# EAGLE design ad7249 (EAGLE 6.1)
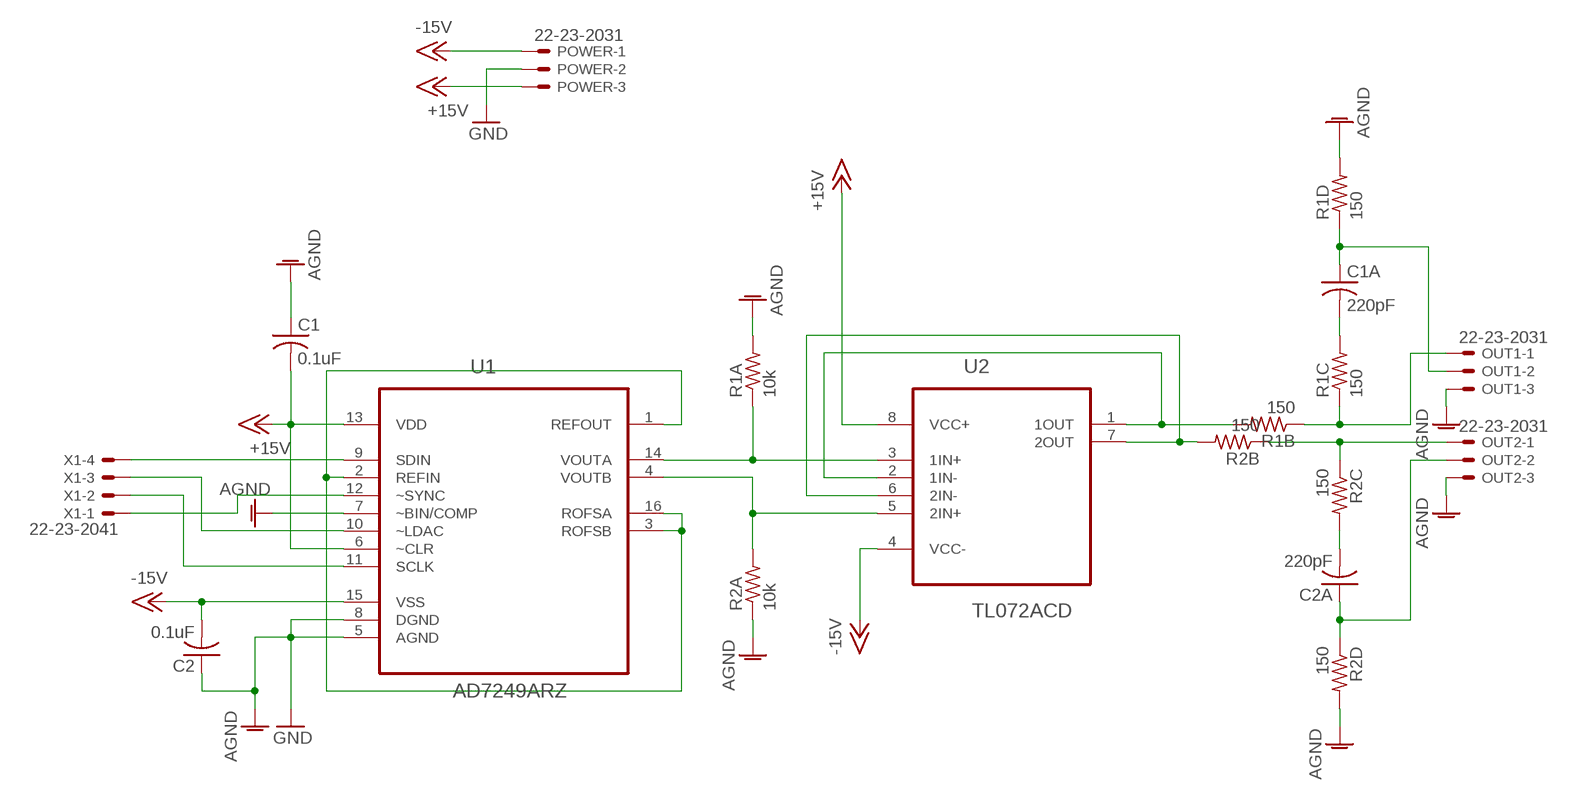
[diagram p0: schematic, sheet 1]

## Parts
C1  0.1uF  C-USC1206  [C1206]
C1A  220pF  C-USC1206  [C1206]
C2  0.1uF  C-USC1206  [C1206]
C2A  220pF  C-USC1206  [C1206]
OUT1  22-23-2031  [22-23-2031]
OUT2  22-23-2031  [22-23-2031]
POWER  22-23-2031  [22-23-2031]
R1A  10k  R-US_R1206  [R1206]
R1B  150  R-US_R1206  [R1206]
R1C  150  R-US_R1206  [R1206]
R1D  150  R-US_R1206  [R1206]
R2A  10k  R-US_R1206  [R1206]
R2B  150  R-US_R1206  [R1206]
R2C  150  R-US_R1206  [R1206]
R2D  150  R-US_R1206  [R1206]
U1  AD7249ARZ  [SOIC127P1042X272-16N]
U2  TL072ACD  [SOIC127P600X175-8N]
X1  22-23-2041  [22-23-2041]

## Nets
+15V: C1.2 POWER.3 U1.6(~CLR) U1.13(VDD) U2.8(VCC+)
-15V: C2.2 POWER.1 U1.15(VSS) U2.4(VCC-)
AGND: C1.1 C2.1 OUT1.3 OUT2.3 POWER.2 R1A.2 R1D.2 R2A.1 R2D.2 U1.5(AGND) U1.7(~BIN/COMP) U1.8(DGND) ; supply symbol labelled GND
N$1: U1.1(REFOUT) U1.2(REFIN) U1.3(ROFSB) U1.16(ROFSA)
N$2: R1A.1 U1.14(VOUTA) U2.3(1IN+)
N$3: R2A.2 U1.4(VOUTB) U2.5(2IN+)
N$4: OUT2.1 R2B.1 R2C.1
N$5: U1.9(SDIN) X1.4
N$6: R1B.2 U2.1(1OUT) U2.2(1IN-)
N$7: R2B.2 U2.6(2IN-) U2.7(2OUT)
N$8: C2A.2 R2C.2
N$9: U1.11(SCLK) X1.2
N$10: C1A.2 R1C.2
N$11: C2A.1 OUT2.2 R2D.1
N$12: C1A.1 OUT1.2 R1D.1
N$13: OUT1.1 R1B.1 R1C.1
N$14: U1.10(~LDAC) X1.3
N$15: U1.12(~SYNC) X1.1

## Library data of the parts
C1 C1A C2 C2A = resistor:C-US: CAPACITOR, American symbol
OUT1 OUT2 POWER = con-molex:22-23-2031: .100" (2.54mm) Center Header - 3 Pin; MF: MOLEX; MPN: 22-23-2031; OC_FARNELL: 1462950; OC_NEWARK: 30C0862
R1A R1B R1C R1D R2A R2B R2C R2D = resistor:R-US_: RESISTOR, American symbol
U1 = Analog Devices_By_element14_Batch_1:AD7249ARZ: Dual 12-Bit Serial DACPORT; MPN: AD7249ARZ; OC_FARNELL: 1438401; OC_NEWARK: 87H9980; PACKAGE: SOIC-16; SUPPLIER: Analog Devices
U2 = Texas Instruments_By_element14_Batch_1:TL072ACD: LOW-NOISE JFET-INPUT OPERATIONAL AMPLIFIERS; MPN: TL072ACD; OC_FARNELL: 9593322; OC_NEWARK: 35K1256; PACKAGE: SOIC-8; SUPPLIER: Texas Instruments
X1 = con-molex:22-23-2041: .100" (2.54mm) Center Header - 4 Pin; MF: MOLEX; MPN: 22-23-2041; OC_FARNELL: 1462920; OC_NEWARK: 38C0355

## Board
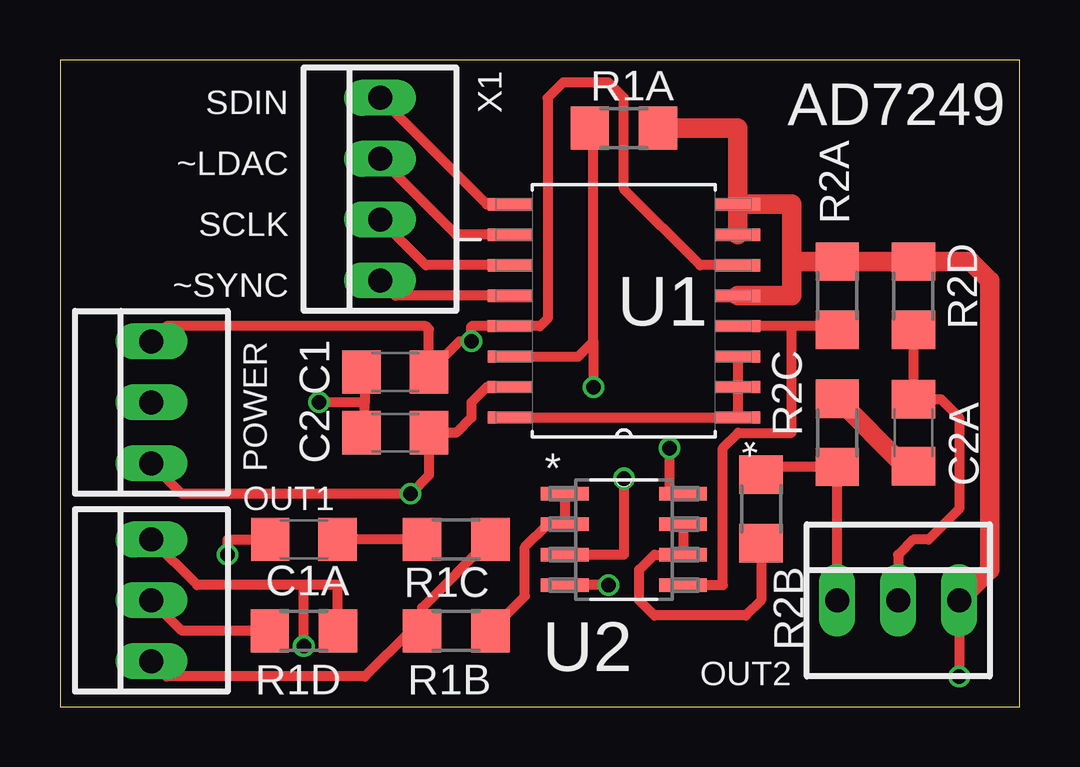
[diagram p1: board, top side]
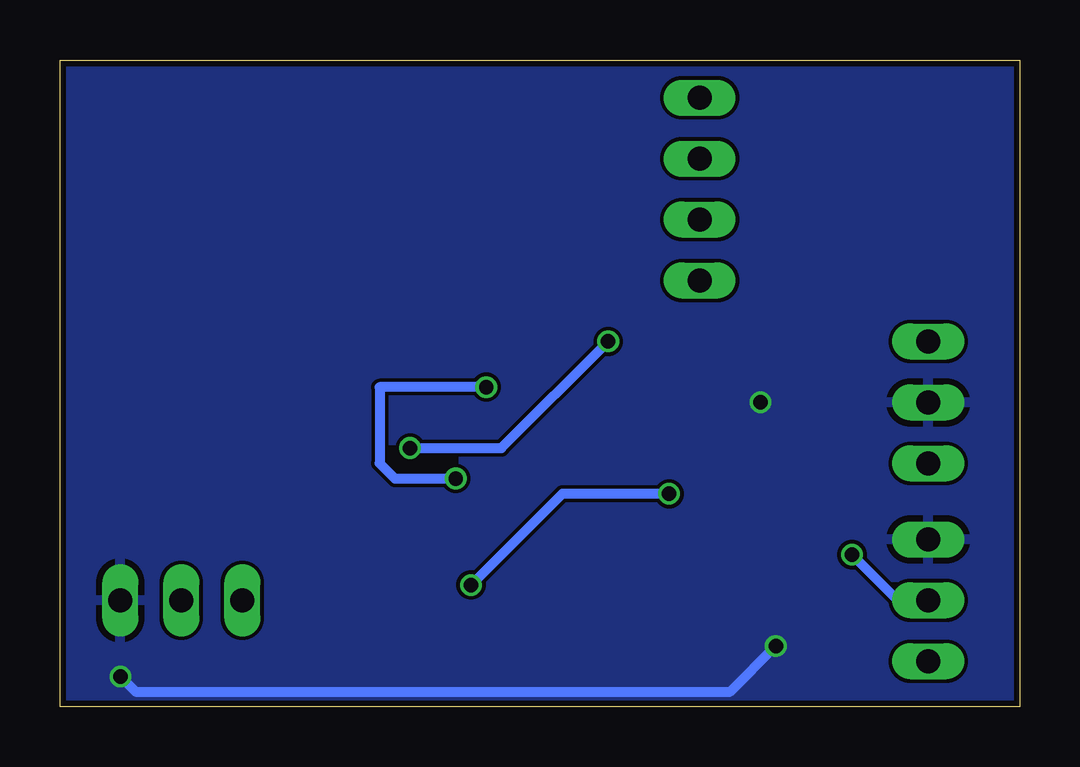
[diagram p2: board, bottom side, seen from below]

Size 39.98 x 26.98 mm. Coordinates in mm from the lower left corner, seen from the top.
Outline: 0,0 39.98,0 39.98,26.98 0,26.98 0,0
Copper layers (1*16): Top 0.035mm / dielectric 1.5mm / Bottom 0.035mm
Design rules: minimum track width 6mil, minimum drill 12mil, track to track 6mil, track to pad 6mil, pad to pad 6mil, via to via 6mil, smd to smd 0mil, copper to edge 10mil, drill to drill 10mil, minimum pad ring 10mil, minimum via ring 6mil, stop-mask expansion 2mil, vias tented up to drill 100mil, thermal gap 10mil

### Footprints (pad centres in the part's own frame; a part is rotated, then mirrored left to right if it is on the bottom)
C1206 = smd 1.6 x 1.8: 1 -1.4,0; 2 1.4,0
22-23-2031 = drill 1 long: 1 -2.54,0; 2 0,0; 3 2.54,0
R1206 = smd 1.6 x 1.803: 1 -1.422,0; 2 1.422,0
SOIC127P1042X272-16N = smd 1.854 x 0.508: 1 -4.75,4.445; 2 -4.75,3.175; 3 -4.75,1.905; 4 -4.75,0.635; 5 -4.75,-0.635; 6 -4.75,-1.905; 7 -4.75,-3.175; 8 -4.75,-4.445; 9 4.75,-4.445; 10 4.75,-3.175; 11 4.75,-1.905; 12 4.75,-0.635; 13 4.75,0.635; 14 4.75,1.905; 15 4.75,3.175; 16 4.75,4.445
SOIC127P600X175-8N = smd 1.981 x 0.559: 1 -2.464,1.905; 2 -2.464,0.635; 3 -2.464,-0.635; 4 -2.464,-1.905; 5 2.464,-1.905; 6 2.464,-0.635; 7 2.464,0.635; 8 2.464,1.905
22-23-2041 = drill 1 long: 1 -3.81,0; 2 -1.27,0; 3 1.27,0; 4 3.81,0

### Placement (x,y rotation side)
C1  13.97,13.97 0 top
C1A  10.16,6.99 0 top
C2  13.97,11.43 0 top
C2A  35.56,11.43 270 top
OUT1  3.81,4.45 90 top
OUT2  34.92,4.45 0 top
POWER  3.81,12.7 90 top
R1A  23.5,24.13 0 top
R1B  16.51,3.17 0 top
R1C  16.51,6.99 180 top
R1D  10.16,3.17 0 top
R2A  32.38,17.14 270 top
R2B  29.21,8.26 270 top
R2C  32.38,11.43 90 top
R2D  35.56,17.14 90 top
U1  23.5,16.51 180 top
U2  23.5,6.99 0 top
X1  13.34,21.59 90 top

### Tracks (layer width: path | path; a pad name or v marks a point on that pad's centre or on a via)
+15V  (via drill 0.6)
  Top 0.406: v25.4,10.79 25.4,8.89 U2.8 | POWER.3 4.45,15.88 15.24,15.88 15.37,15.74 C1.2 16.64,15.24 v17.14,15.24 17.14,15.88 U1.13 20,15.88 20.32,16.19 20.32,25.4 20.95,26.04 22.86,26.04 23.5,25.4 23.5,21.59 26.67,18.41 U1.6
  Bottom 0.406: v17.14,15.24 21.59,10.79 v25.4,10.79
-15V  (via drill 0.6)
  Top 0.406: v22.86,5.08 U2.4 | U1.15 17.78,13.34 17.14,12.7 17.14,12.06 16.51,11.43 C2.2 15.37,9.65 v14.61,8.89 5.08,8.89 POWER.1
  Bottom 0.406: v22.86,5.08 19.05,8.89 v14.61,8.89
AGND  (via drill 0.6)
  Top 0.406: R1D.2 11.58,5.08 10.16,5.08 | 10.16,5.08 5.71,5.08 OUT1.3 | v10.16,2.54 10.16,5.08 | OUT2.3 v37.47,1.27 | 12.7,12.7 12.7,13.97 C1.1 | 12.7,12.7 v10.79,12.7 | 12.7,12.7 12.7,11.43 C2.1
  Top 0.813: U1.8 30.48,20.95 30.48,18.57 | 30.48,18.57 30.48,17.14 U1.5 | 30.48,18.57 R2A.1 R2D.2 37.95,18.57 38.73,17.78 38.73,5.71 OUT2.3 | U1.8 U1.7 | R1A.2 28.25,24.13 U1.8
  Bottom 0.406: v10.16,2.54 12.06,0.64 36.83,0.64 v37.47,1.27
  pour Bottom: 0.32,26.67 39.69,26.67 39.69,0.32 0.32,0.32
N$1
  Top 0.406: U1.3 U1.2 U1.1 U1.16
N$2  (via drill 0.6)
  Top 0.406: 22.23,15.24 22.23,24.13 R1A.1 | 22.23,15.24 21.59,14.61 U1.14 | U2.3 23.5,6.35 v23.5,9.53 | 22.23,15.24 v22.23,13.34
  Bottom 0.406: v23.5,9.53 26.04,9.53 26.67,10.16 26.67,13.34 v22.23,13.34
N$3
  Top 0.406: R2A.2 32.23,15.88 30.48,15.88 | 30.48,15.88 U1.4 | U2.5 27.62,5.08 27.62,10.79 28.26,11.43 30.48,11.43 30.48,15.88
N$4
  Top 0.406: R2B.1 29.54,10.01 R2C.1 OUT2.1
N$5
  Top 0.406: U1.9 17.78,20.95 X1.4
N$6
  Top 0.406: U2.1 U2.2 20.32,7.62 19.37,6.67 19.37,4.61 R1B.2
N$7
  Top 0.406: U2.7 U2.6 24.77,6.35 24.13,5.71 24.13,4.45 24.77,3.81 28.57,3.81 29.21,4.45 R2B.2
N$8
  Top 0.813: C2A.2 35.21,10.03 R2C.2
N$9
  Top 0.406: U1.11 15.24,18.41 X1.2
N$10
  Top 0.406: 15.24,6.99 R1C.2 C1A.2
N$11
  Top 0.406: R2D.1 C2A.1 36.7,12.83 37.47,12.06 37.47,8.26 36.2,6.99 35.56,6.99 34.92,6.35 OUT2.2
N$12  (via drill 0.6)
  Top 0.406: 8.74,6.96 C1A.1 6.99,6.99 v6.99,6.35 | R1D.1 5.08,3.17 OUT1.2
  Bottom 0.406: v6.99,6.35 5.08,4.45 OUT1.2
N$13
  Top 0.406: OUT1.1 4.45,1.27 12.7,1.27 14.61,3.17 R1B.1 15.09,4.14 R1C.1
N$14
  Top 0.406: U1.10 16.51,19.68 X1.3
N$15
  Top 0.406: U1.12 13.97,17.14 X1.1

### Text on the board
tNames: SDIN | AD7249 | ~LDAC | SCLK | ~SYNC